# EAGLE design solenoid-driver-module (EAGLE 5.12)
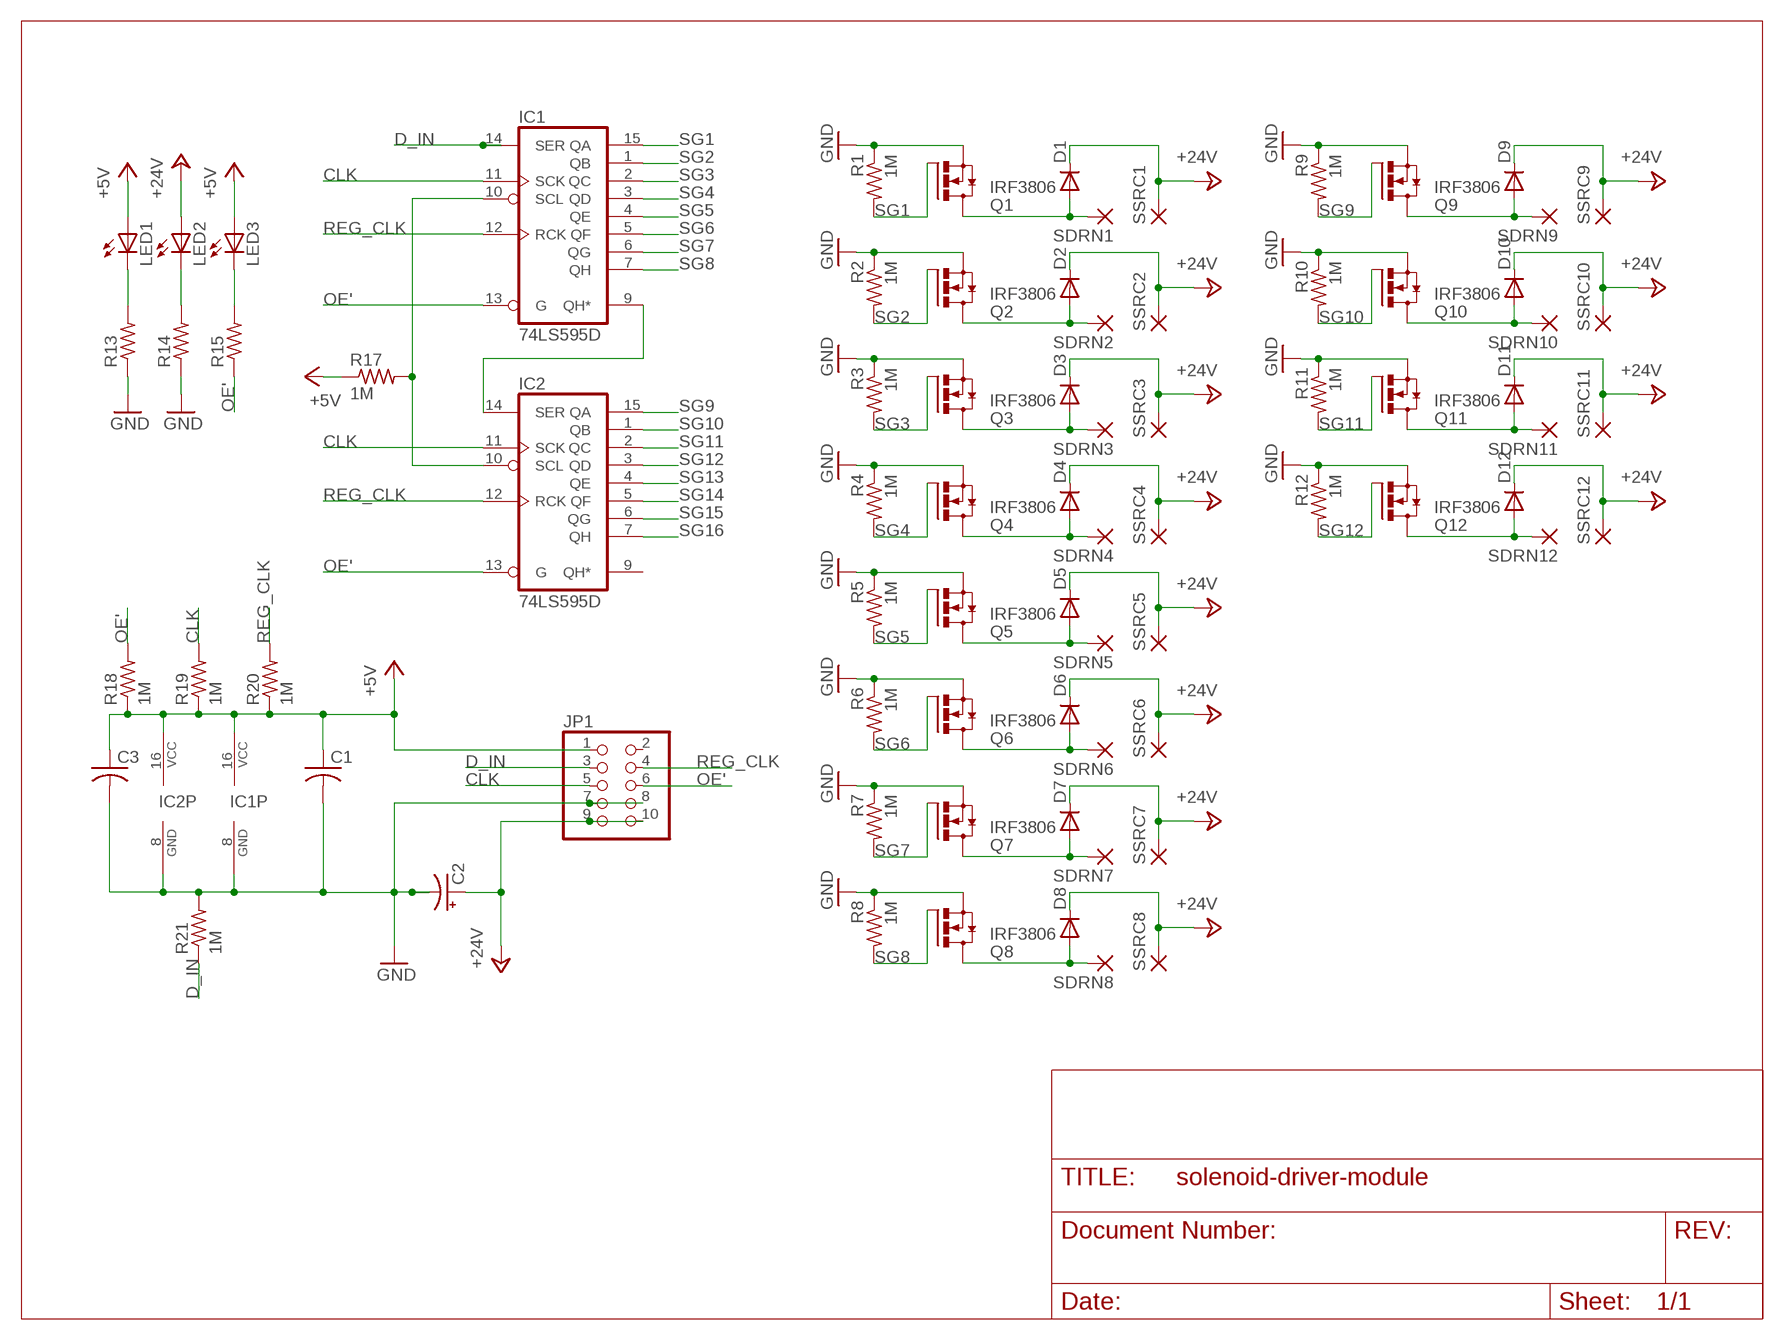
[diagram p0: schematic, sheet 1]

## Parts
C1  C-USC1206  [C1206]
C2  CPOL-USC  [PANASONIC_C]
C3  C-USC1206  [C1206]
D1  DIODE-DO214AC  [DO214AC]
D2  DIODE-DO214AC  [DO214AC]
D3  DIODE-DO214AC  [DO214AC]
D4  DIODE-DO214AC  [DO214AC]
D5  DIODE-DO214AC  [DO214AC]
D6  DIODE-DO214AC  [DO214AC]
D7  DIODE-DO214AC  [DO214AC]
D8  DIODE-DO214AC  [DO214AC]
D9  DIODE-DO214AC  [DO214AC]
D10  DIODE-DO214AC  [DO214AC]
D11  DIODE-DO214AC  [DO214AC]
D12  DIODE-DO214AC  [DO214AC]
IC1  74LS595D  [SO16]
IC2  74LS595D  [SO16]
JP1  PINHD-2X5/90  [2X05/90]
LED1  LEDCHIPLED_1206  [CHIPLED_1206]
LED2  LEDCHIPLED_1206  [CHIPLED_1206]
LED3  LEDCHIPLED_1206  [CHIPLED_1206]
Q1  IRF3806  [DPAK]
Q2  IRF3806  [DPAK]
Q3  IRF3806  [DPAK]
Q4  IRF3806  [DPAK]
Q5  IRF3806  [DPAK]
Q6  IRF3806  [DPAK]
Q7  IRF3806  [DPAK]
Q8  IRF3806  [DPAK]
Q9  IRF3806  [DPAK]
Q10  IRF3806  [DPAK]
Q11  IRF3806  [DPAK]
Q12  IRF3806  [DPAK]
R1  1M  R-US_R1206  [R1206]
R2  1M  R-US_R1206  [R1206]
R3  1M  R-US_R1206  [R1206]
R4  1M  R-US_R1206  [R1206]
R5  1M  R-US_R1206  [R1206]
R6  1M  R-US_R1206  [R1206]
R7  1M  R-US_R1206  [R1206]
R8  1M  R-US_R1206  [R1206]
R9  1M  R-US_R1206  [R1206]
R10  1M  R-US_R1206  [R1206]
R11  1M  R-US_R1206  [R1206]
R12  1M  R-US_R1206  [R1206]
R13  R-US_R1206  [R1206]
R14  R-US_R1206  [R1206]
R15  R-US_R1206  [R1206]
R17  1M  R-US_R1206  [R1206]
R18  1M  R-US_R1206  [R1206]
R19  1M  R-US_R1206  [R1206]
R20  1M  R-US_R1206  [R1206]
R21  1M  R-US_R1206  [R1206]
SDRN1  2,54/1,0  [2,54/1,0]
SDRN2  2,54/1,0  [2,54/1,0]
SDRN3  2,54/1,0  [2,54/1,0]
SDRN4  2,54/1,0  [2,54/1,0]
SDRN5  2,54/1,0  [2,54/1,0]
SDRN6  2,54/1,0  [2,54/1,0]
SDRN7  2,54/1,0  [2,54/1,0]
SDRN8  2,54/1,0  [2,54/1,0]
SDRN9  2,54/1,0  [2,54/1,0]
SDRN10  2,54/1,0  [2,54/1,0]
SDRN11  2,54/1,0  [2,54/1,0]
SDRN12  2,54/1,0  [2,54/1,0]
SSRC1  2,54/1,0  [2,54/1,0]
SSRC2  2,54/1,0  [2,54/1,0]
SSRC3  2,54/1,0  [2,54/1,0]
SSRC4  2,54/1,0  [2,54/1,0]
SSRC5  2,54/1,0  [2,54/1,0]
SSRC6  2,54/1,0  [2,54/1,0]
SSRC7  2,54/1,0  [2,54/1,0]
SSRC8  2,54/1,0  [2,54/1,0]
SSRC9  2,54/1,0  [2,54/1,0]
SSRC10  2,54/1,0  [2,54/1,0]
SSRC11  2,54/1,0  [2,54/1,0]
SSRC12  2,54/1,0  [2,54/1,0]

## Nets
+5V: C1.1 C3.1 IC1.16(VCC) IC2.16(VCC) JP1.1 LED1.A LED3.A R17.1 R18.1 R19.1 R20.1
+24V: C2.+ D1.C D2.C D3.C D4.C D5.C D6.C D7.C D8.C D9.C D10.C D11.C D12.C JP1.9 JP1.10 LED2.A SSRC1.1(P) SSRC2.1(P) SSRC3.1(P) SSRC4.1(P) SSRC5.1(P) SSRC6.1(P) SSRC7.1(P) SSRC8.1(P) SSRC9.1(P) SSRC10.1(P) SSRC11.1(P) SSRC12.1(P)
CLK: IC1.11(SCK) IC2.11(SCK) JP1.5 R19.2
D_IN: IC1.14(SER) JP1.3 R21.1
GND: C1.2 C2.- C3.2 IC1.8(GND) IC2.8(GND) JP1.7 JP1.8 Q1.3(S) Q2.3(S) Q3.3(S) Q4.3(S) Q5.3(S) Q6.3(S) Q7.3(S) Q8.3(S) Q9.3(S) Q10.3(S) Q11.3(S) Q12.3(S) R1.1 R2.1 R3.1 R4.1 R5.1 R6.1 R7.1 R8.1 R9.1 R10.1 R11.1 R12.1 R13.1 R14.1 R21.2
N$1: D2.A Q2.4(D) SDRN2.1(P)
N$2: D3.A Q3.4(D) SDRN3.1(P)
N$3: D4.A Q4.4(D) SDRN4.1(P)
N$4: D5.A Q5.4(D) SDRN5.1(P)
N$5: D6.A Q6.4(D) SDRN6.1(P)
N$6: D7.A Q7.4(D) SDRN7.1(P)
N$7: D8.A Q8.4(D) SDRN8.1(P)
N$8: IC1.9(QH*) IC2.14(SER)
N$9: D9.A Q9.4(D) SDRN9.1(P)
N$10: IC1.10(SCL) IC2.10(SCL) R17.2
N$11: D10.A Q10.4(D) SDRN10.1(P)
N$12: D11.A Q11.4(D) SDRN11.1(P)
N$13: D12.A Q12.4(D) SDRN12.1(P)
N$14: LED1.C R13.2
N$15: LED2.C R14.2
N$16: LED3.C R15.2
N$19: D1.A Q1.4(D) SDRN1.1(P)
OE': IC1.13(G) IC2.13(G) JP1.6 R15.1 R18.2
REG_CLK: IC1.12(RCK) IC2.12(RCK) JP1.4 R20.2
SG1: IC1.15(QA) Q1.1(G) R1.2
SG2: IC1.1(QB) Q2.1(G) R2.2
SG3: IC1.2(QC) Q3.1(G) R3.2
SG4: IC1.3(QD) Q4.1(G) R4.2
SG5: IC1.4(QE) Q5.1(G) R5.2
SG6: IC1.5(QF) Q6.1(G) R6.2
SG7: IC1.6(QG) Q7.1(G) R7.2
SG8: IC1.7(QH) Q8.1(G) R8.2
SG9: IC2.15(QA) Q9.1(G) R9.2
SG10: IC2.1(QB) Q10.1(G) R10.2
SG11: IC2.2(QC) Q11.1(G) R11.2
SG12: IC2.3(QD) Q12.1(G) R12.2
SG13: IC2.4(QE)
SG14: IC2.5(QF)
SG15: IC2.6(QG)
SG16: IC2.7(QH)
Unconnected: IC2.9(QH*) JP1.2

## Library data of the parts
C1 C3 = rcl:C-US: CAPACITOR, American symbol
C2 = rcl:CPOL-US: POLARIZED CAPACITOR, American symbol
D1-D12 = diode:DIODE-: DIODE
IC1 IC2 = 74xx-us:74*595: 8-bit SHIFT REGISTER, output latch
JP1 = pinhead:PINHD-2X5: PIN HEADER
LED1-LED3 = led:LED: LED OSRAM: - CHIPLED LG R971, LG N971, LY N971, LG Q971, LY Q971, LO R971, LY R971 LH N974, LH R974 LS Q976, LO Q976, LY Q976 LO Q996 - Hyper CHIPLED LW Q18S LB Q993, LB Q99A, LB R99A - SideLED LS A670, LO A670, LY A670, LG A670, LP A670 LB A673, LV A673, LT A673, LW A673 LH A674 LY A675 LS A676, LA A676, LO A676, LY A676, LW A676 LS A679, LY A679, LG A679 - Hyper Micro SIDELED® LS Y876, LA Y876, LO Y876, LY Y876 LT Y87S - SmartLED LW L88C, LW L88S LB L89C, LB L89S, LG L890 LS L89K, LO L89K, LY L89K LS L896, LA L896, LO L896, LY L896 - TOPLED LS T670, LO T670, LY T670, LG T670, LP T670 LSG T670, LSP T670, LSY T670, LOP T670, LYG T670 LG T671, LOG T671, LSG T671 LB T673, LV T673, LT T673, LW T673 LH T674 LS T676, LA T676, LO T676, LY T676, LB T676, LH T676, LSB T676, LW T676 LB T67C, LV T67C, LT T67C, LS T67K, LO T67K, LY T67K, LW E67C LS E67B, LA E67B, LO E67B, LY E67B, LB E67C, LV E67C, LT E67C LW T67C LS T679, LY T679, LG T679 LS T770, LO T770, LY T770, LG T770, LP T770 LB T773, LV T773, LT T773, LW T773 LH T774 LS E675, LA E675, LY E675, LS T675 LS T776, LA T776, LO T776, LY T776, LB T776 LHGB T686 LT T68C, LB T68C - Hyper Mini TOPLED® LB M676 - Mini TOPLED Santana® LG M470 LS M47K, LO M47K, LY M47K Source: http://www.osram.convergy.de LUXEON: - LUMILED® LXK2-PW12-R00, LXK2-PW12-S00, LXK2-PW14-U00, LXK2-PW14-V00 LXK2-PM12-R00, LXK2-PM12-S00, LXK2-PM14-U00 LXK2-PE12-Q00, LXK2-PE12-R00, LXK2-PE12-S00, LXK2-PE14-T00, LXK2-PE14-U00 LXK2-PB12-K00, LXK2-PB12-L00, LXK2-PB12-M00, LXK2-PB14-N00, LXK2-PB14-P00, LXK2-PB14-Q00 LXK2-PR12-L00, LXK2-PR12-M00, LXK2-PR14-Q00, LXK2-PR14-R00 LXK2-PD12-Q00, LXK2-PD12-R00, LXK2-PD12-S00 LXK2-PH12-R00, LXK2-PH12-S00 LXK2-PL12-P00, LXK2-PL12-Q00, LXK2-PL12-R00 Source: www.luxeon.com KINGBRIGHT: KA-3528ASYC Source: www.kingbright.com
Q1-Q12 = typewriter-project:IRF*3806
R1-R15 R17-R21 = rcl:R-US_: RESISTOR, American symbol
SDRN1-SDRN12 SSRC1-SSRC12 = wirepad:2,54/1,0: THROUGH-HOLE PAD

## Board
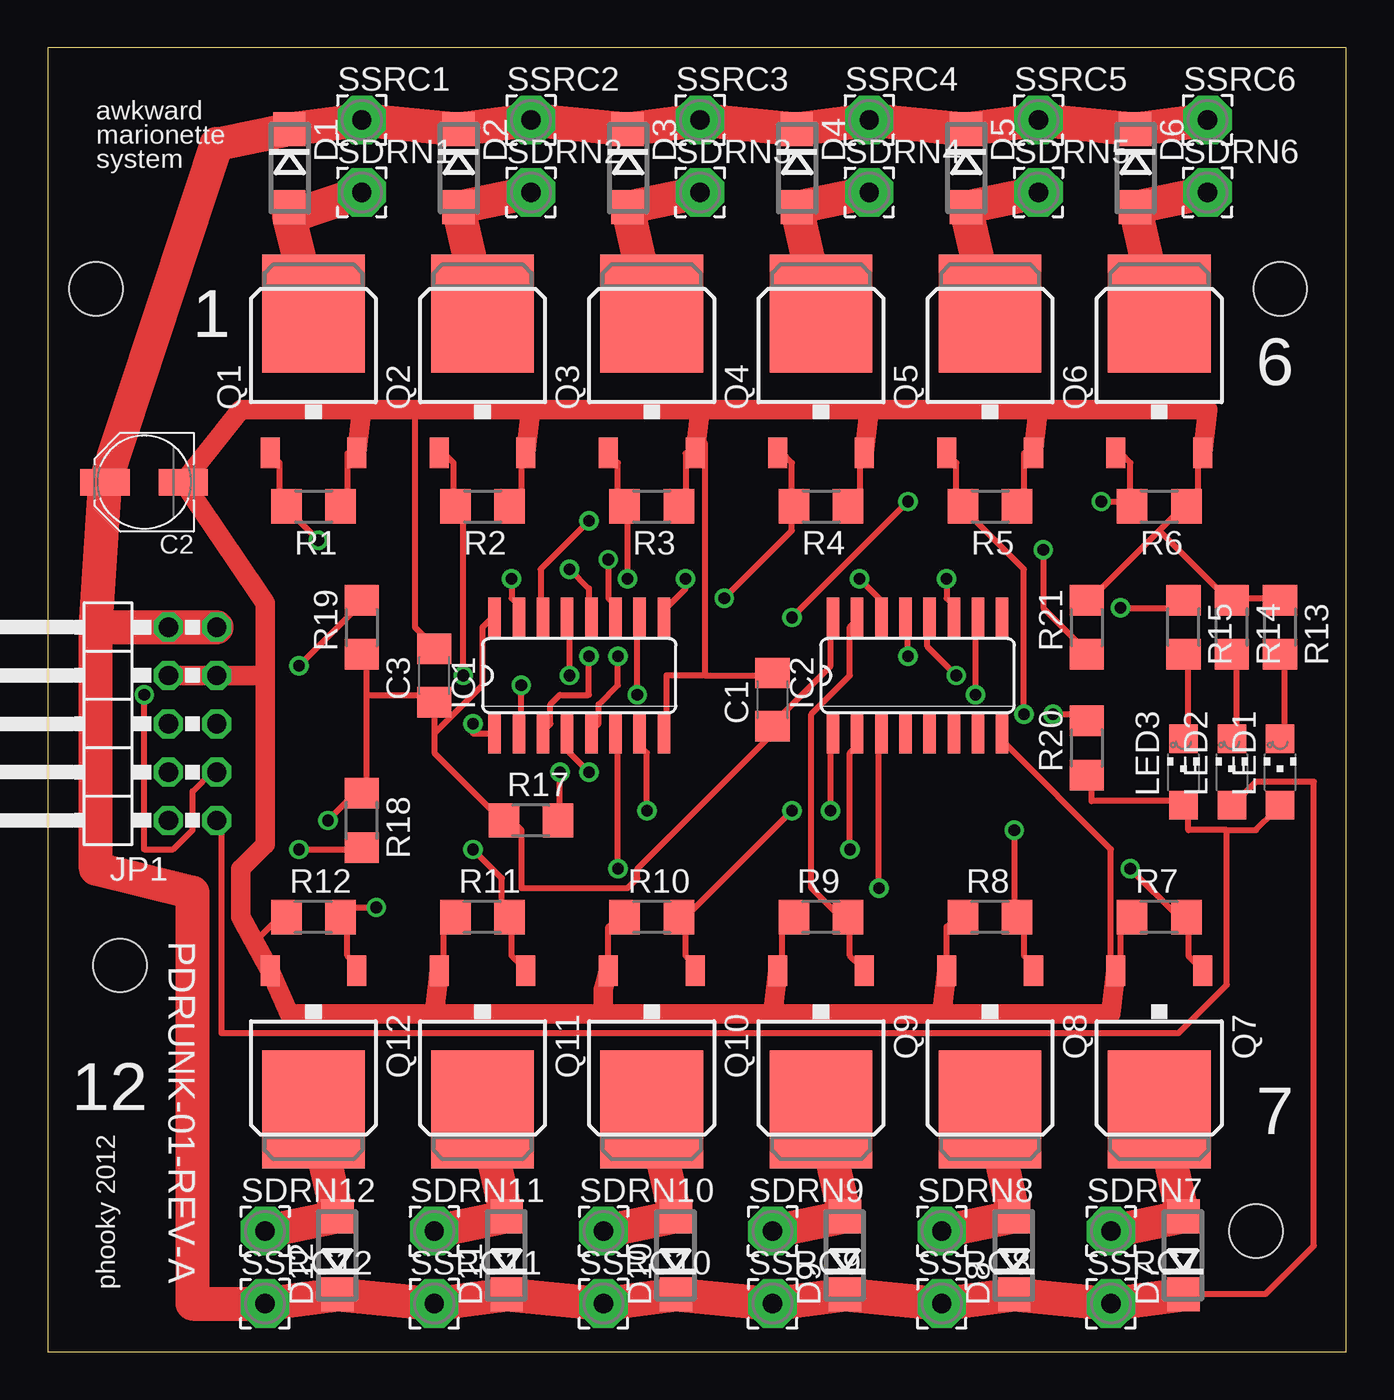
[diagram p1: board, top side]
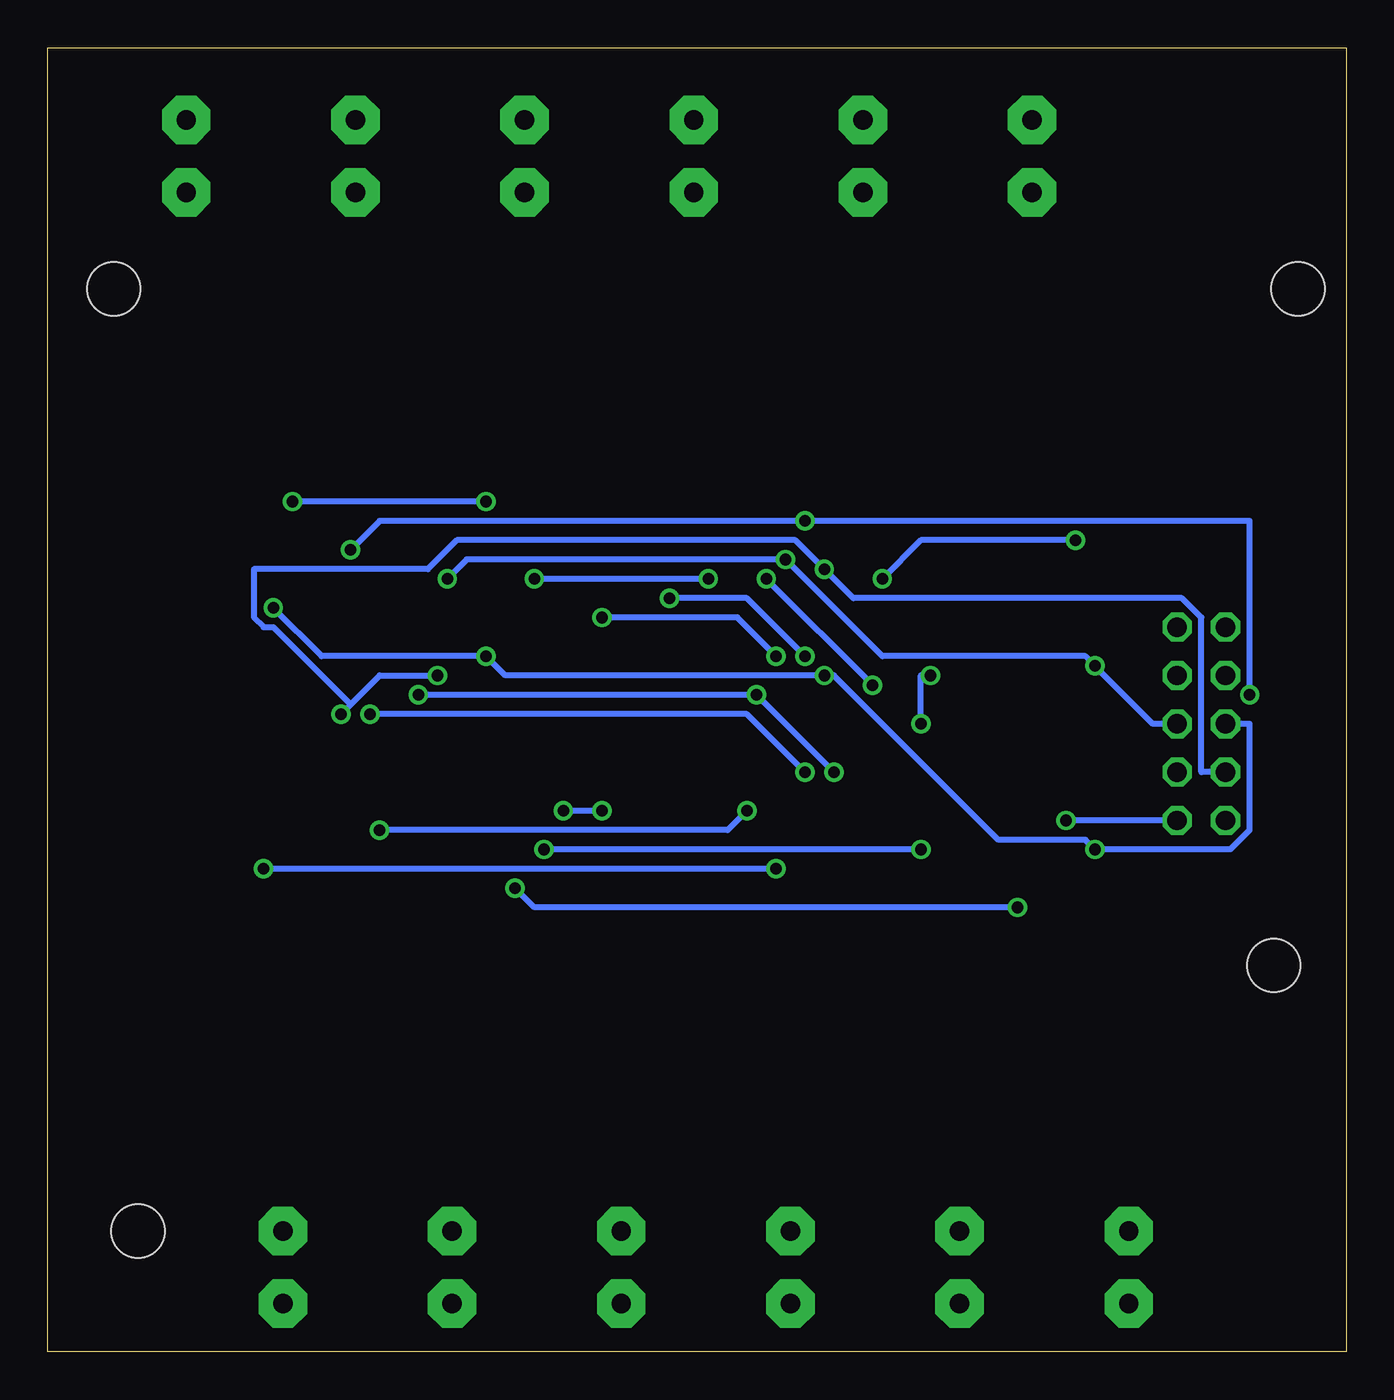
[diagram p2: board, bottom side, seen from below]

Size 68.25 x 68.57 mm. Coordinates in mm from the lower left corner, seen from the top.
Outline: 0,0 68.25,0 68.25,68.57 0,68.57 0,0
Copper layers (1*16): Top 0.035mm / dielectric 1.5mm / Bottom 0.035mm
Design rules "default *": minimum track width 12mil, minimum drill 24mil, track to track 12mil, track to pad 12mil, pad to pad 12mil, via to via 12mil, smd to smd 12mil, copper to edge 40mil, drill to drill 8mil, minimum pad ring 10mil, minimum via ring 8mil, stop-mask expansion 4mil, vias tented up to drill 0mil, thermal gap 10mil
Holes 2.8 mm at 2.54,55.88 3.81,20.32 64.77,55.88 63.5,6.35

### Footprints (pad centres in the part's own frame; a part is rotated, then mirrored left to right if it is on the bottom)
C1206 = smd 1.6 x 1.8: 1 -1.4,0; 2 1.4,0
PANASONIC_C = smd 2.6 x 1.4: + 2.05,0; - -2.05,0
DO214AC = smd 1.8 x 1.7: A 2.05,0; C -2.05,0
SO16 = smd 0.66 x 2.032: 1 -4.445,-3.073; 2 -3.175,-3.073; 3 -1.905,-3.073; 4 -0.635,-3.073; 5 0.635,-3.073; 6 1.905,-3.073; 7 3.175,-3.073; 8 4.445,-3.073; 9 4.445,3.073; 10 3.175,3.073; 11 1.905,3.073; 12 0.635,3.073; 13 -0.635,3.073; 14 -1.905,3.073; 15 -3.175,3.073; 16 -4.445,3.073
2X05/90 = drill 1.016 octagon: 1 -5.08,-6.35; 2 -5.08,-3.81; 3 -2.54,-6.35; 4 -2.54,-3.81; 5 0,-6.35; 6 0,-3.81; 7 2.54,-6.35; 8 2.54,-3.81; 9 5.08,-6.35; 10 5.08,-3.81
CHIPLED_1206 = smd 1.5 x 1.5: A 0,-1.75; C 0,1.75
DPAK = smd 1 x 1.6: 1 -2.28,-7.34; 3 2.28,-7.34 | smd 5.4 x 6.2: 4 0,-0.04
R1206 = smd 1.6 x 1.803: 1 -1.422,0; 2 1.422,0
2,54/1,0 = drill 1.016 pad 2.54 octagon: 1 0,0

### Placement (x,y rotation side)
C1  38.1,34.29 90 top
C2  5.08,45.72 180 top
C3  20.32,35.56 90 top
D1  12.7,62.23 270 top
D2  21.59,62.23 270 top
D3  30.48,62.23 270 top
D4  39.37,62.23 270 top
D5  48.26,62.23 270 top
D6  57.15,62.23 270 top
D7  59.69,5.08 90 top
D8  50.8,5.08 90 top
D9  41.91,5.08 90 top
D10  33.02,5.08 90 top
D11  24.13,5.08 90 top
D12  15.24,5.08 90 top
IC1  27.94,35.56 0 top
IC2  45.72,35.56 0 top
JP1  2.54,33.02 90 top
LED1  64.77,30.48 0 top
LED2  62.23,30.48 0 top
LED3  59.69,30.48 0 top
Q1  13.97,54.61 0 top
Q2  22.86,54.61 0 top
Q3  31.75,54.61 0 top
Q4  40.64,54.61 0 top
Q5  49.53,54.61 0 top
Q6  58.42,54.61 0 top
Q7  58.42,12.7 180 top
Q8  49.53,12.7 180 top
Q9  40.64,12.7 180 top
Q10  31.75,12.7 180 top
Q11  22.86,12.7 180 top
Q12  13.97,12.7 180 top
R1  13.97,44.45 180 top
R2  22.86,44.45 180 top
R3  31.75,44.45 180 top
R4  40.64,44.45 180 top
R5  49.53,44.45 180 top
R6  58.42,44.45 180 top
R7  58.42,22.86 0 top
R8  49.53,22.86 0 top
R9  40.64,22.86 0 top
R10  31.75,22.86 0 top
R11  22.86,22.86 0 top
R12  13.97,22.86 0 top
R13  64.77,38.1 270 top
R14  62.23,38.1 270 top
R15  59.69,38.1 270 top
R17  25.4,27.94 0 top
R18  16.51,27.94 270 top
R19  16.51,38.1 90 top
R20  54.61,31.75 90 top
R21  54.61,38.1 90 top
SDRN1  16.51,60.96 0 top
SDRN2  25.4,60.96 0 top
SDRN3  34.29,60.96 0 top
SDRN4  43.18,60.96 0 top
SDRN5  52.07,60.96 0 top
SDRN6  60.96,60.96 0 top
SDRN7  55.88,6.35 0 top
SDRN8  46.99,6.35 0 top
SDRN9  38.1,6.35 0 top
SDRN10  29.21,6.35 0 top
SDRN11  20.32,6.35 0 top
SDRN12  11.43,6.35 0 top
SSRC1  16.51,64.77 0 top
SSRC2  25.4,64.77 0 top
SSRC3  34.29,64.77 0 top
SSRC4  43.18,64.77 0 top
SSRC5  52.07,64.77 0 top
SSRC6  60.96,64.77 0 top
SSRC7  55.88,2.54 0 top
SSRC8  46.99,2.54 0 top
SSRC9  38.1,2.54 0 top
SSRC10  29.21,2.54 0 top
SSRC11  20.32,2.54 0 top
SSRC12  11.43,2.54 0 top

### Tracks (layer width: path | path; a pad name or v marks a point on that pad's centre or on a via)
+5V  (via drill 0.61)
  Top 0.305: R20.1 54.86,29.97 54.86,28.96 59.44,28.96 LED3.A 59.94,28.45 59.94,27.43 61.98,27.43 | 61.98,27.43 63.5,27.43 64.52,28.45 LED1.A | IC2.16 41.15,38.61 41.15,36.07 38.1,33.02 C1.1 38.1,32.51 30.99,25.4 30.99,24.89 30.48,24.38 24.89,24.38 24.89,27.43 24.38,27.94 R17.1 23.88,27.94 20.32,31.5 20.32,32.51 | 16.76,34.54 20.32,34.54 C3.1 20.32,32.51 | 16.76,34.54 16.76,36.58 R19.1 | 16.76,34.54 16.76,29.46 R18.1 16.26,29.46 v14.73,27.94 | 20.32,32.51 22.86,35.05 22.86,38.1 23.37,38.61 IC1.16 | 61.98,27.43 61.98,19.3 59.44,16.76 9.14,16.76 9.14,27.94 JP1.1
  Bottom 0.305: JP1.1 v14.73,27.94
+24V
  Top 0.305: LED2.A 62.48,28.96 63.5,29.97 66.55,29.97 66.55,5.59 64.01,3.05 60.45,3.05 D7.C
  Top 1.778: SSRC6.1 D6.C SSRC5.1 D5.C SSRC4.1 D4.C SSRC3.1 D3.C SSRC2.1 D2.C SSRC1.1 D1.C 8.89,63.5 C2.+ 2.54,38.1 | 2.54,38.1 2.54,25.4 7.62,24.13 7.62,2.54 SSRC12.1 D12.C SSRC11.1 D11.C SSRC10.1 D10.C SSRC9.1 D9.C SSRC8.1 D8.C SSRC7.1 D7.C | 2.54,38.1 JP1.10 JP1.9
CLK  (via drill 0.61)
  Top 0.305: v13.21,36.07 16.26,39.12 R19.2 | v29.46,41.66 29.46,39.62 29.97,39.12 IC1.11 | v47.24,40.64 47.24,39.62 47.75,39.12 IC2.11
  Bottom 0.305: JP1.5 10.16,33.02 v13.21,36.07 13.72,36.58 24.38,36.58 v29.46,41.66 46.23,41.66 v47.24,40.64
D_IN  (via drill 0.61)
  Top 0.305: v52.32,42.16 52.32,39.12 54.36,37.08 R21.1 | v28.45,43.69 25.91,41.15 25.91,39.12 IC1.14 | v5.08,34.54 5.08,26.42 6.6,26.42 7.62,27.43 7.62,29.46 8.64,30.48 JP1.3
  Bottom 0.305: v52.32,42.16 50.8,43.69 v28.45,43.69 5.08,43.69 v5.08,34.54
GND
  Top 0.305: R13.1 64.52,39.62 62.48,39.62 R14.1 61.98,39.62 58.42,43.18 | 58.42,43.18 59.44,44.2 R6.1 59.94,44.7 60.45,45.21 60.45,47.24 Q6.3 | 58.42,43.18 54.86,39.62 R21.2 | 34.54,35.56 32.51,35.56 32.51,32.51 IC1.8 | 34.54,35.56 38.1,35.56 C1.2 | C3.2 20.32,37.08 19.3,38.1 19.3,49.53 | R12.1 12.19,22.86 11.18,21.84 10.82,21.65 | R11.1 21.34,22.86 20.83,22.35 20.83,20.32 Q11.3 | R10.1 29.97,22.86 29.46,22.35 29.46,20.32 Q10.3 | R9.1 39.12,22.86 38.61,22.35 38.61,20.32 Q9.3 | R8.1 47.75,22.86 47.24,22.35 47.24,20.32 Q8.3 | R1.1 15.75,44.7 15.75,47.24 Q1.3 | R2.1 24.38,44.7 24.89,45.21 24.89,47.24 Q2.3 | R3.1 33.53,44.7 33.53,47.24 Q3.3 | R7.1 56.9,22.86 56.39,22.35 56.39,20.32 Q7.3 55.88,20.32 55.88,26.42 50.29,32 IC2.8 | R4.1 42.16,44.7 42.67,45.21 42.67,47.24 Q4.3 | R5.1 51.31,44.7 51.31,47.24 Q5.3 | 34.54,35.56 34.54,47.75 34.09,47.8
  Top 1.016: 16.51,49.53 19.3,49.53 25.4,49.53 | 25.4,49.53 34.29,49.53 | 34.29,49.53 43.18,49.53 | 43.18,49.53 52.07,49.53 | 52.07,49.53 60.96,49.53 Q6.3 | 52.07,49.53 Q5.3 | 43.18,49.53 Q4.3 | 34.29,49.53 34.09,47.8 Q3.3 | 25.4,49.53 Q2.3 | 16.51,49.53 Q1.3 | 16.51,49.53 10.16,49.53 C2.- 11.43,39.37 11.43,35.56 | 11.43,35.56 11.43,26.67 10.16,25.4 10.16,22.86 10.82,21.65 Q12.3 12.7,17.78 20.32,17.78 | 11.43,35.56 JP1.7 JP1.8 | Q7.3 55.88,17.78 46.99,17.78 | 20.32,17.78 29.21,17.78 | 29.21,17.78 38.1,17.78 | 38.1,17.78 46.99,17.78 | 20.32,17.78 Q11.3 | Q10.3 29.21,19.05 29.21,17.78 | 38.1,17.78 Q9.3 | 46.99,17.78 Q8.3
N$1
  Top 1.778: Q2.4 D2.A SDRN2.1
N$2
  Top 1.778: Q3.4 D3.A SDRN3.1
N$3
  Top 1.778: Q4.4 D4.A SDRN4.1
N$4
  Top 1.778: Q5.4 D5.A SDRN5.1
N$5
  Top 1.778: Q6.4 D6.A SDRN6.1
N$6
  Top 1.778: Q7.4 D7.A SDRN7.1
N$7
  Top 1.778: Q8.4 D8.A SDRN8.1
N$8  (via drill 0.61)
  Top 0.305: v33.53,40.64 33.53,40.13 32.51,39.12 IC1.9 | v42.67,40.64 43.69,39.62 43.69,39.12 IC2.14
  Bottom 0.305: v33.53,40.64 v42.67,40.64
N$9
  Top 1.778: Q9.4 D9.A SDRN9.1
N$10  (via drill 0.61)
  Top 0.305: v26.92,30.48 26.92,27.94 R17.2 | v30.99,34.54 30.99,38.61 IC1.10 | v48.77,34.54 48.77,38.61 IC2.10
  Bottom 0.305: v26.92,30.48 v30.99,34.54 v48.77,34.54
N$11
  Top 1.778: Q10.4 D10.A SDRN10.1
N$12
  Top 1.778: Q11.4 D11.A SDRN11.1
N$13
  Top 1.778: SDRN12.1 D12.A Q12.4
N$14
  Top 0.305: LED1.C 65.02,32.51 65.02,36.58 R13.2
N$15
  Top 0.305: LED2.C 62.48,32.51 62.48,36.58 R14.2
N$16
  Top 0.305: LED3.C 59.94,32.51 59.94,36.58 R15.2
N$19
  Top 0.305: 12.7,60.45 D1.A 12.7,59.69
  Top 1.778: SDRN1.1 12.7,59.69 Q1.4
OE'  (via drill 0.61)
  Top 0.305: v13.21,26.42 16.26,26.42 R18.2 | v56.39,39.12 59.44,39.12 R15.1 | v45.21,36.58 45.21,38.61 IC2.13 | v27.43,35.56 27.43,38.61 IC1.13
  Bottom 0.305: JP1.6 5.08,33.02 5.08,27.43 6.1,26.42 v13.21,26.42 13.72,26.92 18.29,26.92 26.92,35.56 v27.43,35.56 44.2,35.56 v45.21,36.58 53.85,36.58 v56.39,39.12
REG_CLK  (via drill 0.61)
  Top 0.305: v52.83,33.53 54.36,33.53 R20.2 | v47.75,35.56 46.23,37.08 46.23,38.61 IC2.12 | v27.43,41.15 28.45,40.13 28.45,39.12 IC1.12
  Bottom 0.305: 52.32,34.04 50.8,35.56 v47.75,35.56 | 52.32,34.04 v52.83,33.53 | JP1.4 7.62,30.48 7.62,38.61 8.64,39.62 25.91,39.62 v27.43,41.15 28.96,42.67 46.74,42.67 48.26,41.15 57.4,41.15 57.4,38.61 56.9,38.1 56.39,38.1 52.32,34.04
SG1  (via drill 0.61)
  Top 0.305: Q1.1 11.68,47.24 12.19,46.74 12.19,44.7 R1.2 12.7,44.2 v14.22,42.67 | v24.38,40.64 24.38,39.62 24.89,39.12 IC1.15
  Bottom 0.305: v24.38,40.64 22.35,42.67 v14.22,42.67
SG2  (via drill 0.61)
  Top 0.305: Q2.1 20.83,47.24 21.34,46.74 21.34,44.7 R2.2 21.84,44.2 v21.84,35.56 | v22.35,33.02 22.35,32.51 23.37,32.51 IC1.1
  Bottom 0.305: v22.35,33.02 22.35,35.56 v21.84,35.56
SG3  (via drill 0.61)
  Top 0.305: Q3.1 29.46,47.24 29.97,46.74 29.97,44.7 R3.2 30.48,44.2 v30.48,40.64 | v24.89,35.05 24.89,32.51 IC1.2
  Bottom 0.305: v24.89,35.05 v30.48,40.64
SG4  (via drill 0.61)
  Top 0.305: Q4.1 38.61,47.24 39.12,46.74 39.12,44.7 R4.2 39.12,44.2 39.12,43.18 v35.56,39.62 | v28.45,36.58 28.45,34.54 26.92,34.54 26.42,34.04 26.42,33.02 25.91,32.51 IC1.3
  Bottom 0.305: v28.45,36.58 31.5,39.62 v35.56,39.62
SG5  (via drill 0.61)
  Top 0.305: Q5.1 47.24,47.24 47.75,46.74 47.75,44.7 R5.2 48.26,44.2 51.31,41.15 v51.31,33.53 | v28.45,30.48 27.43,31.5 27.43,32 IC1.4
  Bottom 0.305: v28.45,30.48 31.5,33.53 v51.31,33.53
SG6  (via drill 0.61)
  Top 0.305: 56.9,44.7 56.9,46.74 56.39,47.24 Q6.1 | v29.97,36.58 29.97,35.05 28.96,34.04 28.96,33.02 28.45,32.51 IC1.5 | v39.12,38.61 v45.21,44.7 | v55.37,44.7 56.9,44.7 | 56.9,44.7 R6.2
  Bottom 0.305: v29.97,36.58 32,38.61 v39.12,38.61 | v45.21,44.7 v55.37,44.7
SG7  (via drill 0.61)
  Top 0.305: Q7.1 60.45,20.32 59.94,20.83 59.94,22.86 R7.2 59.44,22.86 v56.9,25.4 | v29.97,25.4 29.97,32 IC1.6
  Bottom 0.305: v29.97,25.4 v56.9,25.4
SG8  (via drill 0.61)
  Top 0.305: Q8.1 51.82,20.32 51.31,20.83 51.31,22.86 R8.2 50.8,22.86 v50.8,27.43 | v31.5,28.45 31.5,31.5 30.99,32 IC1.7
  Bottom 0.305: v31.5,28.45 32.51,27.43 v50.8,27.43
SG9
  Top 0.305: Q9.1 42.67,20.32 42.16,20.83 42.16,22.86 R9.2 41.66,22.86 40.13,24.38 40.13,33.53 42.16,35.56 42.16,38.1 42.67,38.61 IC2.15
SG10  (via drill 0.61)
  Top 0.305: 33.53,22.86 33.53,20.83 34.04,20.32 Q10.1 | v41.15,28.45 41.15,32 IC2.1 | 33.53,22.86 v39.12,28.45 | 33.53,22.86 R10.2
  Bottom 0.305: v39.12,28.45 v41.15,28.45
SG11  (via drill 0.61)
  Top 0.305: Q11.1 24.89,20.32 24.38,20.83 24.38,22.86 R11.2 23.88,22.86 23.88,24.89 v22.35,26.42 | v42.16,26.42 42.16,31.5 42.67,32 IC2.2
  Bottom 0.305: v22.35,26.42 v42.16,26.42
SG12  (via drill 0.61)
  Top 0.305: 15.75,22.86 15.75,20.83 16.26,20.32 Q12.1 | v43.69,24.38 43.69,32 IC2.3 | v17.27,23.37 15.75,23.37 15.75,22.86 | 15.75,22.86 R12.2
  Bottom 0.305: v43.69,24.38 42.67,23.37 v17.27,23.37

### Text on the board
tPlace: awkward | marionette | system | 1 | 6 | PDRUNK-01-REV-A | 12 | phooky 2012 | 7